# EasyEDA Pro project FOC_Explore.epro

# Schematic Schematic1
Board Name: Board1; Create Date: 2026-02-25; Page Name: P1; Project Name: GD32F303_FOC_Explorer; Schematic Name: Schematic1; Update Date: 2026-03-28; Company: 嘉立创EDA; Page Size: A4; Version: V1.0
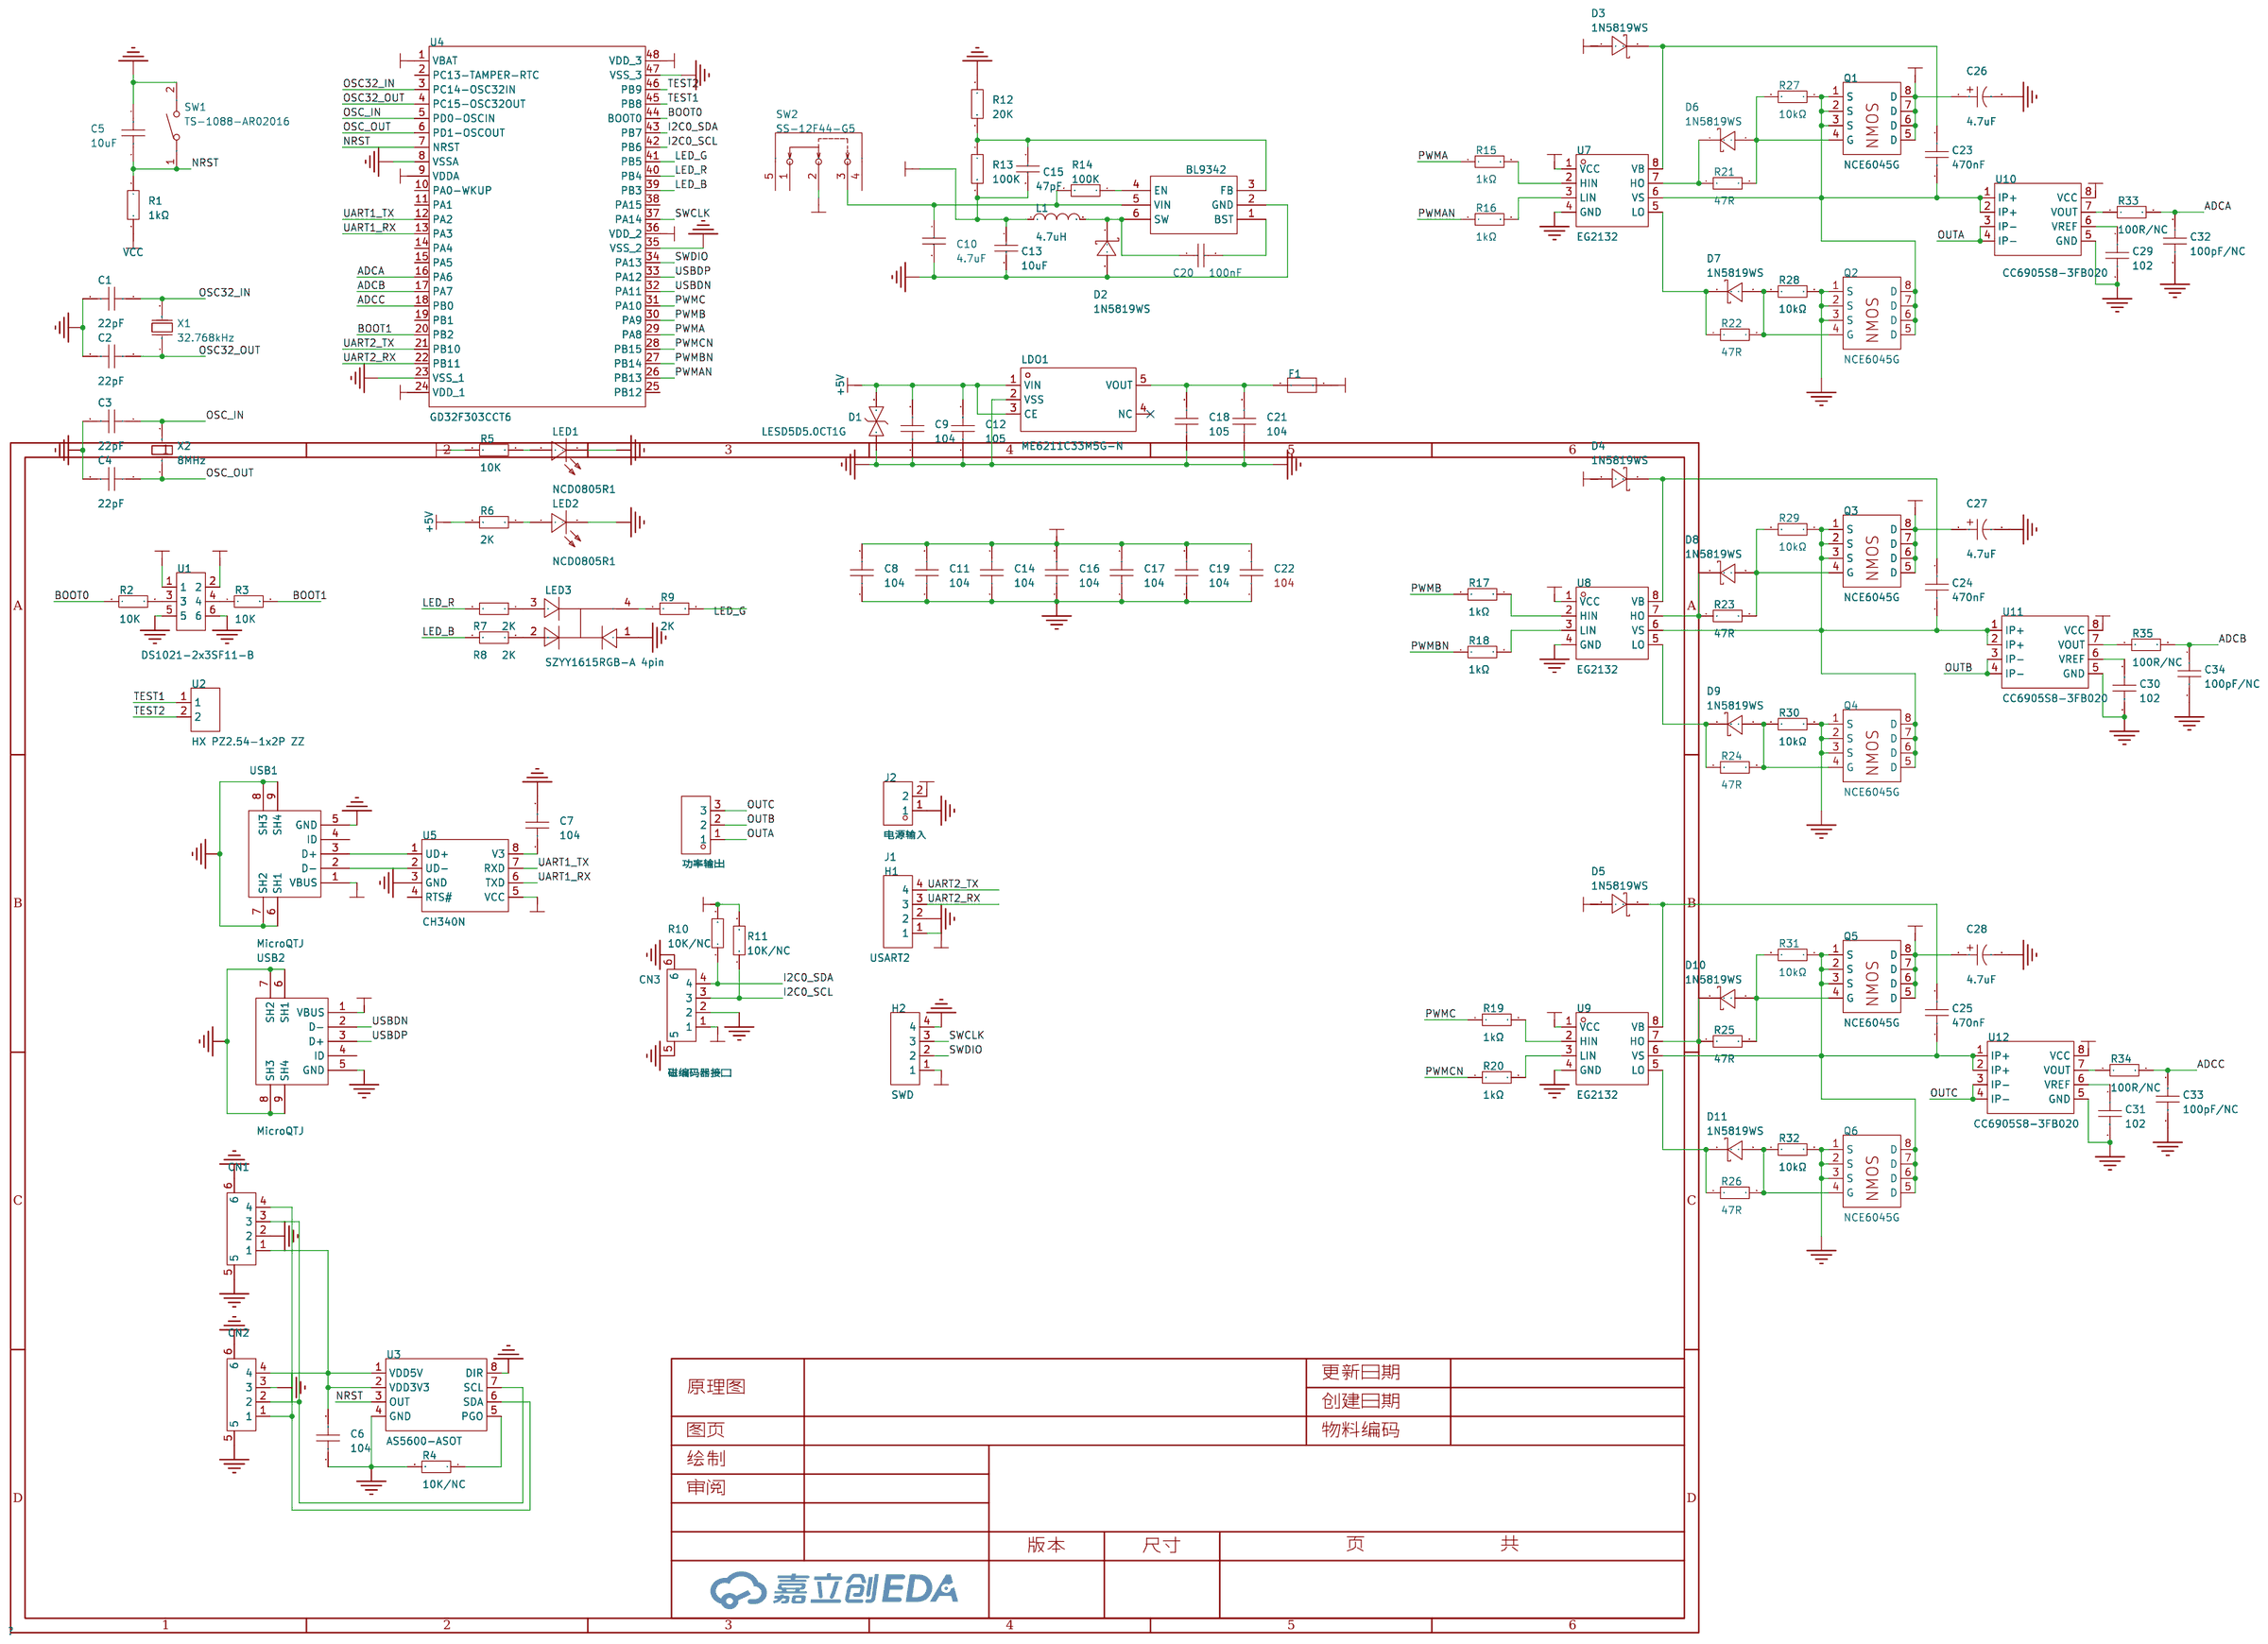
[diagram p0: schematic sheet]

## Parts
C1  22pF  [C0603]
C2  22pF  [C0603]
C3  22pF  [C0603]
C4  22pF  [C0603]
C5  10uF  [C0603]
C6  104  [C0603]
C7  104  [C0603]
C8  104  [C0603]
C9  104  [C0603]
C10  4.7uF  [C0603]
C11  104  [C0603]
C12  105  [C0603]
C13  10uF  [C0603]
C14  104  [C0603]
C15  47pF  [C0603]
C16  104  [C0603]
C17  104  [C0603]
C18  105  [C0603]
C19  104  [C0603]
C20  100nF  [C0603]
C21  104  [C0603]
C22  104  [C0603]
C23  470nF  [C0603]
C24  470nF  [C0603]
C25  470nF  [C0603]
C26  4.7uF  [CAP-SMD_L3.5-W2.8-FD]
C27  4.7uF  [CAP-SMD_L3.5-W2.8-FD]
C28  4.7uF  [CAP-SMD_L3.5-W2.8-FD]
C29  102  [C0603]
C30  102  [C0603]
C31  102  [C0603]
C32  100pF/NC  [C0603]
C33  100pF/NC  [C0603]
C34  100pF/NC  [C0603]
CN1  HX SH-1.0-4PWT  [CONN-SMD_4P-HX-SH-1.0-4PWT]
CN2  HX SH-1.0-4PWT  [CONN-SMD_4P-HX-SH-1.0-4PWT]
CN3  磁编码器接口  [CONN-SMD_4P-HX-SH-1.0-4PWT]
D1  LESD5D5.0CT1G  [SOD-523_L1.2-W0.8-LS1.6-BI]
D2  1N5819WS  [SOD-323_L1.8-W1.3-LS2.5-RD]
D3  1N5819WS  [SOD-323_L1.8-W1.3-LS2.5-RD]
D4  1N5819WS  [SOD-323_L1.8-W1.3-LS2.5-RD]
D5  1N5819WS  [SOD-323_L1.8-W1.3-LS2.5-RD]
D6  1N5819WS  [SOD-323_L1.8-W1.3-LS2.5-RD]
D7  1N5819WS  [SOD-323_L1.8-W1.3-LS2.5-RD]
D8  1N5819WS  [SOD-323_L1.8-W1.3-LS2.5-RD]
D9  1N5819WS  [SOD-323_L1.8-W1.3-LS2.5-RD]
D10  1N5819WS  [SOD-323_L1.8-W1.3-LS2.5-RD]
D11  1N5819WS  [SOD-323_L1.8-W1.3-LS2.5-RD]
F1  JK-SMD0603-002-30  [F0603]
H1  USART2  [HDR-TH_A254UP-ZD04P]
H2  SWD  [HDR-TH_A254UP-ZD04P]
J1  功率输出  [CONN-TH_XY300V-A-5.0-3P]
J2  电源输入  [CONN-TH_XY301V-A-5.0-2P]
L1  4.7uH  [IND-SMD_L4.4-W4.2]
LDO1  ME6211C33M5G-N  [SOT-23-5_L3.0-W1.7-P0.95-LS2.8-BL]
LED1  NCD0805R1  [LED0805-R-RD]
LED2  NCD0805R1  [LED0805-R-RD]
LED3  SZYY1615RGB-A 4pin  [LED-ARRAY-SMD_4P-L1.6-W1.5_SZYY1615RGB-A]
Q1  NCE6045G  [DFN-8_L5.8-W4.9-P1.27-LS6.1-BL-2]
Q2  NCE6045G  [DFN-8_L5.8-W4.9-P1.27-LS6.1-BL-2]
Q3  NCE6045G  [DFN-8_L5.8-W4.9-P1.27-LS6.1-BL-2]
Q4  NCE6045G  [DFN-8_L5.8-W4.9-P1.27-LS6.1-BL-2]
Q5  NCE6045G  [DFN-8_L5.8-W4.9-P1.27-LS6.1-BL-2]
Q6  NCE6045G  [DFN-8_L5.8-W4.9-P1.27-LS6.1-BL-2]
R1  1kΩ  [R0603]
R2  10K  [R0603]
R3  10K  [R0603]
R4  10K/NC  [R0603]
R5  10K  [R0603]
R6  2K  [R0603]
R7  2K  [R0603]
R8  2K  [R0603]
R9  2K  [R0603]
R10  10K/NC  [R0603]
R11  10K/NC  [R0603]
R12  20K  [R0603]
R13  100K  [R0603]
R14  100K  [R0603]
R15  1kΩ  [R0603]
R16  1kΩ  [R0603]
R17  1kΩ  [R0603]
R18  1kΩ  [R0603]
R19  1kΩ  [R0603]
R20  1kΩ  [R0603]
R21  47R  [R0603]
R22  47R  [R0603]
R23  47R  [R0603]
R24  47R  [R0603]
R25  47R  [R0603]
R26  47R  [R0603]
R27  10kΩ  [R0603]
R28  10kΩ  [R0603]
R29  10kΩ  [R0603]
R30  10kΩ  [R0603]
R31  10kΩ  [R0603]
R32  10kΩ  [R0603]
R33  100R/NC  [R0603]
R34  100R/NC  [R0603]
R35  100R/NC  [R0603]
SW1  TS-1088-AR02016  [SW-SMD_L3.9-W3.0-P4.45]
SW2  SS-12F44-G5  [SW-TH_SS-12F44-G5]
U1  DS1021-2x3SF11-B  [HDR-TH_6P-P2.54-V-M-R2-C3-S2.54]
U2  HX PZ2.54-1x2P ZZ  [HDR-TH_2P-P2.54-V-M-3]
U3  AS5600-ASOT  [SOIC-8_L5.0-W4.0-P1.27-LS6.0-BL]
U4  GD32F303CCT6  [LQFP-48_L7.0-W7.0-P0.50-LS9.0-BL]
U5  CH340N  [SOP-8_L4.9-W3.9-P1.27-LS6.0-BL]
U6  BL9342  [SOT-23-6_L2.9-W1.6-P0.95-LS2.8-BL]
U7  EG2132  [SOP-8_L4.9-W3.9-P1.27-LS6.0-BL]
U8  EG2132  [SOP-8_L4.9-W3.9-P1.27-LS6.0-BL]
U9  EG2132  [SOP-8_L4.9-W3.9-P1.27-LS6.0-BL]
U10  CC6905S8-3FB020  [SOIC-8_L4.9-W3.9-P1.27-LS6.0-BL]
U11  CC6905S8-3FB020  [SOIC-8_L4.9-W3.9-P1.27-LS6.0-BL]
U12  CC6905S8-3FB020  [SOIC-8_L4.9-W3.9-P1.27-LS6.0-BL]
USB1  MicroQTJ  [MICRO-USB-SMD_MICROQTJ-5P]
USB2  MicroQTJ  [MICRO-USB-SMD_MICROQTJ-5P]
X1  32.768kHz  [CRYSTAL-SMD_L3.2-W1.5-1]
X2  8MHz  [CRYSTAL-SMD_L5.0-W3.2]

## Library data of the parts
C1-C5 C23-C25 C29-C34 = 0805DS106K250NT: LCSC Part Name: 贴片电容; Supplier Part: C18213216; Manufacturer: FH(风华); Supplier Footprint: 0805; JLCPCB Part Class: 扩展库; Datasheet: https://atta.szlcsc.com/upload/public/pdf/source/20220211/3FDF6092789FC56E23A16E03DC7301F9.pdf; Supplier: LCSC
C6-C9 C11 C12 C14 C16-C19 C21 C22 = 0603DS106M160NT: LCSC Part Name: 贴片电容; Supplier Part: C18213200; Manufacturer: FH(风华); Supplier Footprint: 0603; JLCPCB Part Class: 扩展库; Datasheet: https://atta.szlcsc.com/upload/public/pdf/source/20220211/3FDF6092789FC56E23A16E03DC7301F9.pdf; Supplier: LCSC
C10 = 33pF: Supplier: LCSC; Manufacturer Part: CL10C330JB8NNNC; Manufacturer: SAMSUNG(三星); Supplier Part: C1663; JLCPCB Part Class: Basic Part; nameAlias: Value; spicePre: C; spiceSymbolName: CL10C330JB8NNNC
C13 C15 C20 = 100nF: Supplier: LCSC; Manufacturer: FH(风华); Manufacturer Part: 0603B104K500NT; Supplier Part: C30926; JLCPCB Part Class: Extended Part; nameAlias: Value; spicePre: C; spiceSymbolName: 0603B104K500NT
C26-C28 = 178MU0017: 容值:4.7uF;精度:±10%;额定电压:25V;等效串联电阻(ESR):6Ω@120kHz;; LCSC Part Name: 4.7uF ±10% 25V; Supplier Part: C18164641; Manufacturer: KNSCHA(科尼盛); Supplier Footprint: CASE-B-3528-19(mm); JLCPCB Part Class: 扩展库; Datasheet: https://item.szlcsc.com/datasheet/178MU0017/19306582.html; Supplier: LCSC; Tolerance: ±10%; Voltage Rating: 25V; Equivalent Series Resistance(ESR): 6Ω@120kHz; Operating Temperature: -55℃~+125℃
CN1-CN3 = HX SH-1.0-4PWT: 插针结构:1x4P;间距:1mm;安装方式:卧贴;参考系列:SH;总PIN数:4P;排数:1;每排PIN数:4;行距:-;额定电流:1A;触头材质:磷铜;触头镀层:锡;工作温度:-25℃~+85℃;; LCSC Part Name: 1x4P 间距:1mm 卧贴 系列:SH; Supplier Part: C22461259; Manufacturer: hanxia(韩下); Supplier Footprint: SMD,P=1mm,卧贴; JLCPCB Part Class: 扩展库; Datasheet: https://item.szlcsc.com/datasheet/HX%2520SH-1.0-4PWT/24139177.html; Supplier: LCSC; Pins Structure: 1x4P; Pitch: 1mm; Mounting Type: 卧贴; Reference Series: SH; Number of Pins: 4P; Number of Rows: 1; Number of PINs Per Row: 4; Current Rating: 1A; Contact Material: 磷铜; Contact Plating: 锡; Operating Temperature: -25℃~+85℃; Voltage Rating: 50V; Plastic Material: LCP; Flame Retardant Rating: UL94V-0; Color: 米色
D1 = LESD5D5.0CT1G_C7433850: 极性:-;反向截止电压(Vrwm):5V;钳位电压:15V;峰值脉冲电流(Ipp):5A;峰值脉冲功率(Ppp):75W;击穿电压:9V;; Supplier Part: C7433850; Manufacturer: KUU; Supplier Footprint: SOD-523; JLCPCB Part Class: 扩展库; Datasheet: https://item.szlcsc.com/datasheet/LESD5D5.0CT1G/8442902.html; Supplier: LCSC; Reverse Stand-Off Voltage (Vrwm): 5V; Clamping Voltage: 15V; Peak Pulse Current (Ipp): 5A; Peak Pulse Power Dissipation (Ppp): 75W; Voltage - Breakdown: 9V; Reverse Leakage Current (Ir): 1uA; Number of Channels: 单路; Operating Temperature: -40℃~+150℃; level of protection: IEC 61000-4-2；IEC 61000-4-4; Type: ESD; Junction Capacitance: 15pF
D2 = 1N5819WS_C191023: 正向压降(Vf):600mV@1A;直流反向耐压(Vr):40V;整流电流:1A;; LCSC Part Name: 电压:40V 电流:1A; Supplier Part: C191023; Manufacturer: Hottech(合科泰); Supplier Footprint: SOD-323; JLCPCB Part Class: 基础库; Datasheet: https://item.szlcsc.com/datasheet/1N5819WS/213850.html; Supplier: LCSC; Voltage - Forward(Vf@If): 600mV@1A; Voltage - DC Reverse(Vr): 40V; Current - Rectified: 1A; Non-Repetitive Peak Forward Surge Current: 25A
D3-D11 = 1N5819WS_C191023: 正向压降(Vf):600mV@1A;直流反向耐压(Vr):40V;整流电流:1A;; LCSC Part Name: 电压:40V 电流:1A; Supplier Part: C191023; Manufacturer: Hottech(合科泰); Supplier Footprint: SOD-323; JLCPCB Part Class: 基础库; Datasheet: https://item.szlcsc.com/datasheet/1N5819WS/213850.html; Supplier: LCSC; Voltage - Forward(Vf@If): 600mV@1A; Voltage - DC Reverse(Vr): 40V; Current - Rectified: 1A; Non-Repetitive Peak Forward Surge Current: 25A; Forward Voltage (Vf@If): 600mV@1A; Reverse Voltage (Vr): 40V; Average Rectified Current (Io): 1A
F1 = JK-SMD0603-002-30: LCSC Part Name: 贴片自恢复保险丝; Supplier Part: C5375699; Manufacturer: JK(金科); Supplier Footprint: 0603; JLCPCB Part Class: 扩展库; Supplier: LCSC
H1 H2 = A254UP-ZD04P: 插针结构:1x4P;间距:2.54mm;行距:-;圆针/方针:方针;安装方式:直插;排数:单排;总PIN位数:4P;额定电流:3A;配合针长度:6mm;塑高:2.5mm;触头材质:黄铜;触头镀层:金;工作温度:-40℃~+105℃;颜色:黑色;; LCSC Part Name: 1x4P 间距:2.54mm 方针 直插; Supplier Part: C41413833; Manufacturer: BXCONN(宝讯); Supplier Footprint: 插件,P=2.54mm; JLCPCB Part Class: 扩展库; Datasheet: https://item.szlcsc.com/datasheet/A254UP-ZD04P/43230040.html; Supplier: LCSC; Pin Structure: 1x4P; Pitch: 2.54mm; Circluar Pins/Square Pins: 方针; Mounting Type: 直插; Number of Rows: 单排; Number of Pins: 4P; Current Rating: 3A; Length of Mating Pin: 6mm; Insulation Height: 2.5mm; Contact Material: 黄铜; Contact Plating: 金; Operating Temperature: -40℃~+105℃; Color: 黑色
J1 = XY300V-A-5.0-3P: 结构:1x3P;间距:5mm;颜色:蓝色;安装方式:直插;额定电流:10A;额定电压:300V;排数:1;线规 - AWG:14~22;线规 - 平方毫米:2.5;每排PIN数:3;触头材质:铜;触头镀层:锡;工作温度范围:-;; LCSC Part Name: 1x3P 5mm 直插 排数:1 每排P数:3; Supplier Part: C880594; Manufacturer: XINLAIYA(新莱亚); Supplier Footprint: 插件,P=5mm; JLCPCB Part Class: 扩展库; Datasheet: https://atta.szlcsc.com/upload/public/pdf/source/20201013/C880594_3A8AAA97EC3ECB60314816C92B0C7DE3.pdf; Supplier: LCSC; Structure: 1x3P; Pitch: 5mm; Color: 蓝色; Mounting Style: 直插; Current Rating (Max): 10A; Voltage Rating (Max): 300V; Number of Pins: 3P; Number of Rows: 1; Wire Gauge - AWG: 14~22; Wire Gauge - mm2: 2.5; Number of PINs Per Row: 3; Contact Material: 铜; Contact Plating: 锡; Screw Specification: M3
J2 = XY301V-A-5.0-2P: 结构:1x2P;间距:5mm;颜色:蓝色;安装方式:直插;排数:1;每排PIN数:2;额定电流:15A;额定电压:300V;线规 - AWG:14~22;线规 - 平方毫米:1.5;工作温度:-;; LCSC Part Name: 1x2P 5mm 直插 排数:1 每排P数:2; Supplier Part: C557651; Manufacturer: XINLAIYA(新莱亚); Supplier Footprint: 插件,P=5mm; JLCPCB Part Class: 扩展库; Datasheet: https://item.szlcsc.com/datasheet/XY301V-A-5.0-2P/581014.html; Supplier: LCSC; Number of Positions or Pins: 1x2P; Pitch: 5mm; Color: 蓝色; Mounting Type: 直插; Number of Pins: 2P; Number of Rows: 1; Number of PINs Per Row: 2; Screw Specification: M2.5; Current Rating: 15A; Voltage Rating (Max): 300V; Wire Gauge - AWG: 14~22; Wire Gauge - mm2: 1.5
L1 = XR0420-4R7M: 电感值:4.7uH;精度:±20%;额定电流:2.8A;饱和电流(Isat):3A;类型:一体成型电感;; LCSC Part Name: 4.7uH ±20% 3A; Supplier Part: C5307591; Manufacturer: XR(祥如); Supplier Footprint: SMD,0420; JLCPCB Part Class: 扩展库; Datasheet: https://atta.szlcsc.com/upload/public/pdf/source/20240328/110B611B724D24AB51078DA8F677E482.pdf; Supplier: LCSC; Tolerance: ±20%; Current Rating: 2.8A; Current - Saturation(Isat): 3A; DC Resistance(DCR): 105mΩ; Type: 一体成型电感
LDO1 = ME6211C33M5G-N: 输出类型:固定;最大输入电压:6V;输出电压:3.3V;最大输出电流:500mA;电源纹波抑制比(PSRR):70dB;输出极性:正极;; LCSC Part Name: 输入6V 输出3.3V 500mA; Supplier Part: C82942; Manufacturer: MICRONE(南京微盟); Supplier Footprint: SOT-23-5; JLCPCB Part Class: 扩展库; Datasheet: https://atta.szlcsc.com/upload/public/pdf/source/20170918/C82942_1505727073070976520.pdf; Supplier: LCSC; Output Type: 固定; Maximum Input Voltage: 6V; Output Voltage: 3.3V; MAX Output Current: 500mA; Power Supply Rejection Ratio (PSRR): 70dB; Dropout Voltage: 260mV@(200mA); Output Polarity: 正极; Number of Outputs: 1
LED1 LED2 = NCD0805R1: 灯头类型:-;发光颜色:红色;正向电压(VF):1.6V~2.6V;功率:65mW;正向电流:20mA;主波长:615nm~630nm;二极管配置:独立二极管;透镜颜色:无色透明透镜;色温:-;发光强度:67mcd~195mcd;发光角度:130°;载带方式:-;工作温度:-30℃~+85℃;; Supplier Part: C84256; Manufacturer: 国星光电; Supplier Footprint: 0805; JLCPCB Part Class: 基础库; Datasheet: https://atta.szlcsc.com/upload/public/pdf/source/20200820/C84256_F0A75A43B3EAD75808600A0514C76B99.pdf; Supplier: LCSC; Emitted Color: 红色; Forward Voltage (VF): 1.6V~2.6V; Power Dissipation: 65mW; Forward Current: 20mA; Dominant Wavelength: 615nm~630nm; Diode Configuration: 独立二极管; Lens Color: 无色透明透镜; Luminous Intensity: 67mcd~195mcd; Viewing Angle: 130°; Operating Temperature: -30℃~+85℃
LED3 = SZYY1615RGB-A 4pin: 灯头类型:-;发光颜色:红色,翠绿色,蓝色;正向压降(Vf):2V~2.4V；2.6V~3V；2.6V~3V;功率:90mW；90mW；40mW;正向电流:5mA；5mA；20mA;波长:620nm~624nm；462nm~470nm；515nm~531nm;二极管配置:共阴极;透镜颜色:无色透明透镜;色温:-;发光强度:420mcd；100mcd；280mcd;发光角度:120°;载带方式:-;工作温度:-30℃~+85℃;; LCSC Part Name: 1615红翠绿蓝三色产品; Supplier Part: C3029072; Manufacturer: yongyu(永裕光电); Supplier Footprint: SMD-4P,1.6x1.5mm; JLCPCB Part Class: 扩展库; Datasheet: https://item.szlcsc.com/datasheet/SZYY1615RGB-A%25204pin/3559997.html; Supplier: LCSC; Illumination Color: 红色,翠绿色,蓝色; Voltage - Forward(Vf): 2V~2.4V；2.6V~3V；2.6V~3V; Power(Watts): 90mW；90mW；40mW; Forward Current: 5mA；5mA；20mA; Wavelength - Dominant: 620nm~624nm；462nm~470nm；515nm~531nm; Peak Wavelength: 511nm；462nm；630nm; Diode Configuration: 共阴极; Lens Color: 无色透明透镜; Luminous Intensity: 420mcd；100mcd；280mcd; Viewing Angle: 120°; Operating Temperature: -30℃~+85℃
Q1-Q6 = NCE6045G: 数量:1个N沟道;漏源电压(Vdss):60V;连续漏极电流(Id):45A;导通电阻(RDS(on)):17mΩ@4.5V,20A;耗散功率(Pd):60W;阈值电压(Vgs(th)):1.2V;; LCSC Part Name: 1个N沟道 耐压:60V 电流:45A; Supplier Part: C502794; Manufacturer: NCE(无锡新洁能); Supplier Footprint: DFN5X6-8L; JLCPCB Part Class: 扩展库; Datasheet: https://item.szlcsc.com/datasheet/NCE6045G/515315.html; Supplier: LCSC; Number: 1个N沟道; Drain to Source Voltage: 60V; Current - Continuous Drain(Id): 45A; RDS(on): 17mΩ@4.5V,20A; Pd - Power Dissipation: 60W; Gate Threshold Voltage (Vgs(th)): 1.2V; Gate Charge(Qg): 58nC@30V; Input Capacitance(Ciss): 2.18nF@30V; Reverse Transfer Capacitance (Crss@Vds): 270pF; Operating Temperature: -55℃~+175℃
R1 = 0603WAF1001T5E: 电阻类型:厚膜电阻;阻值:1kΩ;精度:±1%;功率:100mW;最大工作电压:75V;温度系数:±100ppm/℃;; LCSC Part Name: 1kΩ ±1% 100mW 厚膜电阻; Supplier Part: C21190; Manufacturer: UNI-ROYAL(厚声); Supplier Footprint: 0603; JLCPCB Part Class: 基础库; Datasheet: https://atta.szlcsc.com/upload/public/pdf/source/20200306/C422600_1E6D84923E4A46A82E41ADD87F860B5C.pdf; Supplier: LCSC; Type: 厚膜电阻; Tolerance: ±1%; Power(Watts): 100mW; Overload Voltage (Max): 75V; Temperature Coefficient: ±100ppm/℃; Operating Temperature Range: -55℃~+155℃
R2 R3 = RT0603BRD07100KL: 电阻类型:薄膜电阻;阻值:100kΩ;精度:±0.1%;功率:100mW;最大工作电压:75V;温度系数:±25ppm/℃;; LCSC Part Name: 薄膜电阻 100kΩ ±0.1% 100mW; Supplier Part: C122538; Manufacturer: YAGEO(国巨); Supplier Footprint: 0603; JLCPCB Part Class: 扩展库; Datasheet: https://atta.szlcsc.com/upload/public/pdf/source/20170721/C122538_1500619326323834092.pdf; Supplier: LCSC; Type: 薄膜电阻; Tolerance: ±0.1%; Power(Watts): 100mW; Overload Voltage (Max): 75V; Temperature Coefficient: ±25ppm/℃; Operating Temperature Range: -55℃~+155℃
R4 R10 R11 R21-R26 = 0603WAF100JT5E: 电阻类型:厚膜电阻;阻值:10Ω;精度:±1%;功率:100mW;最大工作电压:75V;温度系数:±400ppm/℃;; LCSC Part Name: 10Ω ±1% 100mW 厚膜电阻; Supplier Part: C22859; Manufacturer: UNI-ROYAL(厚声); Supplier Footprint: 0603; JLCPCB Part Class: 基础库; Datasheet: https://atta.szlcsc.com/upload/public/pdf/source/20200306/C422600_1E6D84923E4A46A82E41ADD87F860B5C.pdf; Supplier: LCSC; Type: 厚膜电阻; Tolerance: ±1%; Power(Watts): 100mW; Overload Voltage (Max): 75V; Temperature Coefficient: ±400ppm/℃; Operating Temperature Range: -55℃~+155℃
R5-R9 = RT0603BRE0750RL: 电阻类型:薄膜电阻;阻值:50Ω;精度:±0.1%;功率:100mW;温度系数:±50ppm/℃;; LCSC Part Name: 薄膜电阻 50Ω ±0.1% 100mW; Supplier Part: C849792; Manufacturer: YAGEO(国巨); Supplier Footprint: 0603; JLCPCB Part Class: Extended Part; Datasheet: https://atta.szlcsc.com/upload/public/pdf/source/20200610/C326738_5639A9F1B6EB6E4AE2197577D3456E7F.pdf; Supplier: LCSC; Type: 薄膜电阻; Tolerance: ±0.1%; Power(Watts): 100mW; Temperature Coefficient: ±50ppm/℃; Operating Temperature Range: -55℃~+155℃
R12 = 22kΩ: Supplier: LCSC; Manufacturer: UNI-ROYAL(厚声); Manufacturer Part: 0603WAF2202T5E; Supplier Part: C31850; JLCPCB Part Class: Basic Part; nameAlias: Value; spicePre: R; spiceSymbolName: 0603WAF2202T5E
R13 = 130kΩ: Supplier: LCSC; Manufacturer: UNI-ROYAL(厚声); Manufacturer Part: 0603WAF1303T5E; Supplier Part: C22795; JLCPCB Part Class: Extended Part; nameAlias: Value; spicePre: R; spiceSymbolName: 0603WAF1303T5E
R14 = 124kΩ: Supplier: LCSC; Manufacturer: UNI-ROYAL(厚声); Manufacturer Part: 0603WAF1243T5E; Supplier Part: C22788; JLCPCB Part Class: Extended Part; nameAlias: Value; spicePre: R; spiceSymbolName: 0603WAF1243T5E
R15-R20 R27-R35 = 0603WAF1002T5E: 电阻类型:厚膜电阻;阻值:10kΩ;精度:±1%;功率:100mW;最大工作电压:75V;温度系数:±100ppm/℃;; LCSC Part Name: 厚膜电阻 10kΩ ±1% 100mW; Supplier Part: C25804; Manufacturer: UNI-ROYAL(厚声); Supplier Footprint: 0603; JLCPCB Part Class: 基础库; Datasheet: https://atta.szlcsc.com/upload/public/pdf/source/20200306/C422600_1E6D84923E4A46A82E41ADD87F860B5C.pdf; Supplier: LCSC; Type: 厚膜电阻; Tolerance: ±1%; Power(Watts): 100mW; Overload Voltage (Max): 75V; Temperature Coefficient: ±100ppm/℃; Operating Temperature Range: -55℃~+155℃
SW1 = TS-1088-AR02016: 电路结构:单刀单掷;按钮形状:圆形按钮;作用力:160gf;安装方式:立贴;开关长度:4mm;开关宽度:3mm;开关高度:2mm;带支架:不带;触点电流:50mA;额定电压(DC):12V;绝缘电阻:100MΩ;机械寿命:10万次;; LCSC Part Name: 4*3*2mm 立贴 轻触开关; Supplier Part: C720477; Manufacturer: XUNPU(讯普); Supplier Footprint: SMD; JLCPCB Part Class: 扩展库; Datasheet: https://atta.szlcsc.com/upload/public/pdf/source/20200810/C720475_60D09DD6C54279ADDB2DC25100F1CC11.pdf; Supplier: LCSC; Circuit: 单刀单掷; Actuator Style: 圆形按钮; Operating Force: 160gf; Mounting Style: 立贴; Switch Length: 4mm; Switch Width: 3mm; Switch Height: 2mm; Strike Gundam: 不带; Contact Current: 50mA; Voltage Rating (DC): 12V; Insulation Resistance: 100MΩ; Actuator/Cap Color: 黑色; Pin Style: SMD接片; Mechanical Life: 10万次; Operating Temperature: -30℃~+80℃
SW2 = SS-12F44-G5_C136718: 电路结构:单刀双掷;安装方式:直插;额定电流:-;额定电压:-;工作寿命:5千次;; LCSC Part Name: 直插双档 滑动开关; Supplier Part: C136718; Manufacturer: 韩国韩荣; Supplier Footprint: 插件; JLCPCB Part Class: 扩展库; Datasheet: https://item.szlcsc.com/datasheet/SS-12F44-G5/148034.html; Supplier: LCSC; Circuit: 单刀双掷; Actuator Style: 矩形柱状; Termination Style: PC引脚; Switch Height: 11mm; Mounting Type: 直插; Life: 5千次; Operating Temperature: -25℃~+70℃
U1 = DS1021-2x3SF11-B: 插针结构:2x3P;间距:2.54mm;行距:2.54mm;圆针/方针:方针;安装方式:直插;排数:双排;总PIN位数:6P;额定电流:3A;额定电压:250V;触头材质:铜合金;触头镀层:金;工作温度:-40℃~+105℃;颜色:黑色;; LCSC Part Name: 2x3P 间距:2.54mm 方针 直插; Supplier Part: C7430399; Manufacturer: CONNFLY; Supplier Footprint: 插件,P=2.54mm; JLCPCB Part Class: 扩展库; Datasheet: https://item.szlcsc.com/datasheet/DS1021-2x3SF11-B/8430052.html; Supplier: LCSC; Pin Structure: 2x3P; Pitch: 2.54mm; Row Spacing: 2.54mm; Circluar Pins/Square Pins: 方针; Mounting Type: 直插; Number of Rows: 双排; Number of Pins: 6P; Current Rating: 3A; Voltage Rating (Max): 250V; Contact Material: 铜合金; Contact Plating: 金; Operating Temperature: -40℃~+105℃; Color: 黑色
U2 = HX PZ2.54-1x2P ZZ: 插针结构:1x2P;间距:2.54mm;行距:-;圆针/方针:方针;安装方式:直插;排数:单排;总PIN位数:2P;额定电流:3A;额定电压:1kV;配合针长度:6mm;塑高:2.5mm;端接针长度:3mm;触头材质:黄铜;触头镀层:金;工作温度:-40℃~+105℃;颜色:黑色;; LCSC Part Name: 1x2P 间距:2.54mm 方针 直插; Supplier Part: C32713268; Manufacturer: hanxia(韩下); Supplier Footprint: 插件,P=2.54mm; JLCPCB Part Class: 扩展库; Datasheet: https://item.szlcsc.com/datasheet/HX%2520PZ2.54-1x2P%2520ZZ/34444548.html; Supplier: LCSC; Pin Structure: 1x2P; Pitch: 2.54mm; Circluar Pins/Square Pins: 方针; Mounting Type: 直插; Number of Rows: 单排; Number of Pins: 2P; Current Rating: 3A; Voltage Rating (Max): 1kV; Length of Mating Pin: 6mm; Insulation Height: 2.5mm; Length of End Connection Pin: 3mm; Contact Material: 黄铜; Contact Plating: 金; Operating Temperature: -40℃~+105℃; Color: 黑色
U3 = AS5600-ASOT: 旋转角度范围:0°~360°;; LCSC Part Name: 12位可编程非接触式电位器; Supplier Part: C499458; Manufacturer: ams(艾迈斯半导体); Supplier Footprint: SOIC-8; JLCPCB Part Class: 扩展库; Datasheet: https://item.szlcsc.com/datasheet/AS5600-ASOT/511984.html; Supplier: LCSC; Voltage - Supply: 5V；3.3V; Rotation Angle: 0°~360°
U4 = GD32F303CCT6: CPU内核:ARM Cortex-M4;CPU最大主频:120MHz;; LCSC Part Name: ARM Cortex-M4 32位微控制器; Supplier Part: C116151; Manufacturer: GigaDevice(兆易创新); Supplier Footprint: LQFP-48(7x7); JLCPCB Part Class: 扩展库; Datasheet: https://item.szlcsc.com/datasheet/GD32F303CCT6/117404.html; Supplier: LCSC; CPU Core: ARM Cortex-M4; CPU Maximum Speed: 120MHz; Program Storage Size: 256KB; Program Memory Type: FLASH; Number of I/O: 37; ADC (Bit): 12bit; DAC (Bit): 12bit; Voltage - Supply: 2.6V~3.6V
U5 = CH340N: 应用功能:USB转串口;USB协议版本:USB 2.0;通道数:1;数据速率:2Mbps;; LCSC Part Name: USB2.0芯片CH340; Supplier Part: C2977777; Manufacturer: WCH(南京沁恒); Supplier Footprint: SOP-8; JLCPCB Part Class: 扩展库; Datasheet: https://item.szlcsc.com/datasheet/CH340N/3390257.html; Supplier: LCSC; Applications Function: USB转串口; USB Protocol: USB 2.0; Number of Channels: 1; Voltage - Supply: 3.3V；5V; Data Rate: 2Mbps; Operating Temperature: -20℃~+70℃
U6 = BL9342: Supplier: LCSC; Manufacturer: BL(上海贝岭); Supplier Part: C93176; JLCPCB Part Class: Extended Part; spicePre: U
U7-U9 = EG2132: Supplier Part: C480660; Manufacturer: EG(屹晶微); Supplier Footprint: SOP-8; JLCPCB Part Class: 扩展库; Datasheet: https://atta.szlcsc.com/upload/public/pdf/source/20200107/C480660_1BAA691BD691BEF65957581630E475F6.pdf; Supplier: LCSC
U10-U12 = CC6905S8-3FB020: 电流测量范围:±20A;隔离电压(Vrms):100Vrms;灵敏度:66mV/A;; LCSC Part Name: 高性能霍尔效应电流传感器，多量程可选，高带宽低噪声; Supplier Part: C41421489; Manufacturer: CrossChip(成都芯进); Supplier Footprint: SOP-8; JLCPCB Part Class: 扩展库; Datasheet: https://item.szlcsc.com/datasheet/CC6905S8-3FB020/43260920.html; Supplier: LCSC; Current Range: ±20A; Voltage - Supply: 3.3V; Isolation Voltage(Vrms): 100Vrms; Sensitivity: 66mV/A; Operating Temperature: -40℃~+125℃; Band Width: 230kHz; Current Terminal Resistance: 0.5mΩ; Response Time (tr): 1.5us
USB1 USB2 = MicroQTJ: 连接器类型:Micro-B;协议标准:USB 2.0;公母:母;安装方式:卧贴;触点数量:5P;端口数量:1;额定电流 - 电源:-;工作温度:-30℃~+80℃;; LCSC Part Name: Micro卧贴母座; Supplier Part: C404968; Manufacturer: SHOU HAN(首韩); Supplier Footprint: SMD; JLCPCB Part Class: 扩展库; Datasheet: https://item.szlcsc.com/datasheet/MicroQTJ/392533.html; Supplier: LCSC; Connector Type: Micro-B; Protocol Standard: USB 2.0; Gender: 母; Mounting Type: 卧贴; Number of Contacts: 5P; Number of Ports: 1; Connect-Disconnect Life: 3千次; Detection color: 黑色; Operating Temperature: -30℃~+80℃
X1 = XKXGI-SUA-32.768K: 晶振类型:贴片晶振;频率:32.768kHz;常温频差:±20ppm;负载电容:12.5pF;频率稳定度:±30ppm;; LCSC Part Name: YST310S 32.768KHZ 2P 3215 12.5PF ±20PPM -40~85℃; Supplier Part: C5213671; Manufacturer: YXC(扬兴晶振); Supplier Footprint: SMD3215-2P; JLCPCB Part Class: 扩展库; Datasheet: https://item.szlcsc.com/datasheet/XKXGI-SUA-32.768K/5908943.html; Supplier: LCSC; Type: 贴片晶振; Normal temperature Frequency Tolerance: ±20ppm; Load Capacitance: 12.5pF; Frequency Stability: ±30ppm; Operating Temperature: -40℃~+85℃
X2 = XG1EL89CSI-111YLC-8M: 晶振类型:贴片晶振;频率:8MHz;常温频差:±10ppm;负载电容:20pF;频率稳定度:±20ppm;; LCSC Part Name: 8MHz ±10ppm 20pF; Supplier Part: C5280575; Manufacturer: YXC(扬兴晶振); Supplier Footprint: SMD5032; JLCPCB Part Class: 扩展库; Datasheet: https://atta.szlcsc.com/upload/public/pdf/source/20240329/44922B0AF7B60E58E9B66993B6077277.pdf; Supplier: LCSC; Type: 贴片晶振; Normal temperature Frequency Tolerance: ±10ppm; Load Capacitance: 20pF; Frequency Stability: ±20ppm; Operating Temperature: -40℃~+85℃

## Nets
+3V3: C8.2 C11.2 C14.2 C16.2 C17.2 C19.2 C22.2 CN3.1 F1.2 H1.1 H2.1 R10.2 R11.2 U1.1 U1.2 U4.1(VBAT) U4.9(VDDA) U4.24(VDD_1) U4.36(VDD_2) U4.48(VDD_3) U10.8(VCC) U11.8(VCC) U12.8(VCC)
+5V: C9.2 C12.2 C13.1 C15.2 D1.2 L1.1 LDO1.1(VIN) LDO1.3(CE) R6.2 R13.2 U5.5(VCC) USB1.1(VBUS) USB2.1(VBUS)
+12V: C26.1 C27.1 C28.1 D3.2(A) D4.2(A) D5.2(A) J2.2 Q1.5(D) Q1.6(D) Q1.7(D) Q1.8(D) Q3.5(D) Q3.6(D) Q3.7(D) Q3.8(D) Q5.5(D) Q5.6(D) Q5.7(D) Q5.8(D) R5.2 SW2.2 U7.1(VCC) U8.1(VCC) U9.1(VCC)
GND: C1.2 C2.2 C3.2 C4.2 C5.1 C6.1 C7.2 C8.1 C9.1 C10.2 C11.1 C12.1 C13.2 C14.1 C16.1 C17.1 C18.1 C19.1 C21.1 C22.1 C26.2 C27.2 C28.2 C29.2 C30.2 C31.2 C32.2 C33.2 C34.2 CN1.2 CN1.5 CN1.6 CN2.3 CN2.5 CN2.6 CN3.2 CN3.5 CN3.6 D1.1 D2.2(A) H1.2 H2.4 J2.1 LDO1.2(VSS) LED1.2(-) LED2.2(-) LED3.1(A) Q2.1(S) Q2.2(S) Q2.3(S) Q4.1(S) Q4.2(S) Q4.3(S) Q6.1(S) Q6.2(S) Q6.3(S) R4.2 R12.1 R28.2 R30.2 R32.2 SW1.2 U1.5 U1.6 U3.4(GND) U3.8(DIR) U4.8(VSSA) U4.23(VSS_1) U4.35(VSS_2) U4.47(VSS_3) U5.3(GND) U6.2(GND) U7.4(GND) U8.4(GND) U9.4(GND) U10.5(GND) U11.5(GND) U12.5(GND) USB1.5(GND) USB1.6(SH1) USB1.7(SH2) USB1.8(SH3) USB1.9(SH4) USB2.5(GND) USB2.6(SH1) USB2.7(SH2) USB2.8(SH3) USB2.9(SH4)
VCC: R1.2
ADCA: C32.1 R33.2 U4.16(PA6)
ADCB: C34.1 R35.2 U4.17(PA7)
ADCC: C33.1 R34.2 U4.18(PB0)
BOOT0: R2.1 U4.44(BOOT0)
BOOT1: R3.2 U4.20(PB2)
I2C0_SCL: CN3.3 R11.1 U4.42(PB6)
I2C0_SDA: CN3.4 R10.1 U4.43(PB7)
LED_B: R8.2 U4.39(PB3)
LED_G: R9.2 U4.41(PB5)
LED_R: R7.2 U4.40(PB4)
NRST: C5.2 R1.1 SW1.1 U3.3(OUT) U4.7(NRST)
OSC32_IN: C1.1 U4.3(PC14-OSC32IN) X1.2(OSC2)
OSC32_OUT: C2.1 U4.4(PC15-OSC32OUT) X1.1(OSC1)
OSC_IN: C3.1 U4.5(PD0-OSCIN) X2.1(OSC1)
OSC_OUT: C4.1 U4.6(PD1-OSCOUT) X2.2(OSC2)
OUTA: J1.1 U10.3(IP-) U10.4(IP-)
OUTB: J1.2 U11.3(IP-) U11.4(IP-)
OUTC: J1.3 U12.3(IP-) U12.4(IP-)
PWMA: R15.1 U4.29(PA8)
PWMAN: R16.1 U4.26(PB13)
PWMB: R17.1 U4.30(PA9)
PWMBN: R18.1 U4.27(PB14)
PWMC: R19.1 U4.31(PA10)
PWMCN: R20.1 U4.28(PB15)
SWCLK: H2.3 U4.37(PA14)
SWDIO: H2.2 U4.34(PA13)
TEST1: U2.1 U4.45(PB8)
TEST2: U2.2 U4.46(PB9)
UART1_RX: U4.13(PA3) U5.6(TXD)
UART1_TX: U4.12(PA2) U5.7(RXD)
UART2_RX: H1.3 U4.22(PB11)
UART2_TX: H1.4 U4.21(PB10)
USBDN: U4.32(PA11) USB2.2(D-)
USBDP: U4.33(PA12) USB2.3(D+)
Net-(C6-2): C6.2 CN1.1 CN2.4 U3.1(VDD5V) U3.2(VDD3V3)
Net-(C7-1): C7.1 U5.8(V3)
Net-(C10-1): C10.1 R14.2 SW2.3 U6.5(VIN)
Net-(C15-1): C15.1 R12.2 R13.1 U6.3(FB)
Net-(C18-2): C18.2 C21.2 F1.1 LDO1.5(VOUT)
Net-(C20-1): C20.1 D2.1(K) L1.2 U6.6(SW)
Net-(C20-2): C20.2 U6.1(BST)
Net-(C23-1): C23.1 D3.1(K) U7.8(VB)
Net-(C23-2): C23.2 Q1.1(S) Q1.2(S) Q1.3(S) Q2.5(D) Q2.6(D) Q2.7(D) Q2.8(D) R27.1 U7.6(VS) U10.1(IP+) U10.2(IP+)
Net-(C24-1): C24.1 D4.1(K) U8.8(VB)
Net-(C24-2): C24.2 Q3.1(S) Q3.2(S) Q3.3(S) Q4.5(D) Q4.6(D) Q4.7(D) Q4.8(D) R29.1 U8.6(VS) U11.1(IP+) U11.2(IP+)
Net-(C25-1): C25.1 D5.1(K) U9.8(VB)
Net-(C25-2): C25.2 Q5.1(S) Q5.2(S) Q5.3(S) Q6.5(D) Q6.6(D) Q6.7(D) Q6.8(D) R31.1 U9.6(VS) U12.1(IP+) U12.2(IP+)
Net-(C29-1): C29.1 U10.6(VREF)
Net-(C30-1): C30.1 U11.6(VREF)
Net-(C31-1): C31.1 U12.6(VREF)
Net-(CN1-3): CN1.3 CN2.2 U3.7(SCL)
Net-(CN1-4): CN1.4 CN2.1 U3.6(SDA)
Net-(D6-1): D6.1(K) R21.1 U7.7(HO)
Net-(D6-2): D6.2(A) Q1.4(G) R21.2 R27.2
Net-(D7-1): D7.1(K) R22.1 U7.5(LO)
Net-(D7-2): D7.2(A) Q2.4(G) R22.2 R28.1
Net-(D8-1): D8.1(K) R23.1 U8.7(HO)
Net-(D8-2): D8.2(A) Q3.4(G) R23.2 R29.2
Net-(D9-1): D9.1(K) R24.1 U8.5(LO)
Net-(D9-2): D9.2(A) Q4.4(G) R24.2 R30.1
Net-(D10-1): D10.1(K) R25.1 U9.7(HO)
Net-(D10-2): D10.2(A) Q5.4(G) R25.2 R31.2
Net-(D11-1): D11.1(K) R26.1 U9.5(LO)
Net-(D11-2): D11.2(A) Q6.4(G) R26.2 R32.1
Net-(LED1-1): LED1.1(+) R5.1
Net-(LED2-1): LED2.1(+) R6.1
Net-(LED3-2): LED3.2(A) R8.1
Net-(LED3-3): LED3.3(A) R7.1
Net-(LED3-4): LED3.4(K) R9.1
Net-(R2-2): R2.2 U1.3
Net-(R3-1): R3.1 U1.4
Net-(R4-1): R4.1 U3.5(PGO)
Net-(R14-1): R14.1 U6.4(EN)
Net-(R15-2): R15.2 U7.2(HIN)
Net-(R16-2): R16.2 U7.3(LIN)
Net-(R17-2): R17.2 U8.2(HIN)
Net-(R18-2): R18.2 U8.3(LIN)
Net-(R19-2): R19.2 U9.2(HIN)
Net-(R20-2): R20.2 U9.3(LIN)
Net-(R33-1): R33.1 U10.7(VOUT)
Net-(R34-1): R34.1 U12.7(VOUT)
Net-(R35-1): R35.1 U11.7(VOUT)
Net-(U5-1): U5.1(UD+) USB1.3(D+)
Net-(U5-2): U5.2(UD-) USB1.2(D-)

Not connected (* = marked no-connect by the designer): LDO1 4(NC)*; SW2 1 4 5; U4 2(PC13-TAMPER-RTC) 10(PA0-WKUP) 11(PA1) 14(PA4) 15(PA5) 19(PB1) 25(PB12) 38(PA15); U5 4(RTS#); USB1 4(ID); USB2 4(ID)
